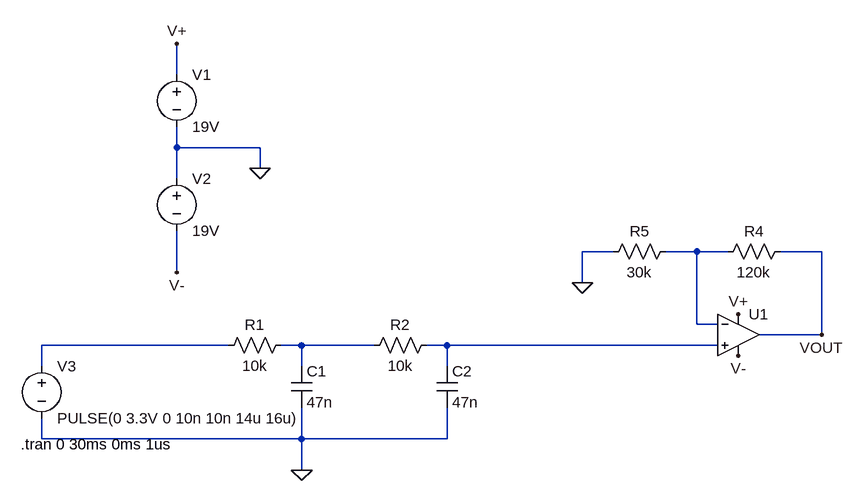
[diagram p0: schematic low_pass_amp.asc]
low_pass_amp.asc, the LTspice schematic file:
Version 4
SHEET 1 1028 680
WIRE -16 -288 -16 -336
WIRE -16 -176 -16 -208
WIRE 112 -176 -16 -176
WIRE 112 -144 112 -176
WIRE -16 -128 -16 -176
WIRE 656 -16 608 -16
WIRE 784 -16 736 -16
WIRE 832 -16 784 -16
WIRE 976 -16 912 -16
WIRE -16 16 -16 -48
WIRE 608 32 608 -16
WIRE 784 96 784 -16
WIRE 816 96 784 96
WIRE 976 112 976 -16
WIRE 976 112 880 112
WIRE 64 128 -224 128
WIRE 176 128 144 128
WIRE 288 128 176 128
WIRE 400 128 368 128
WIRE 816 128 400 128
WIRE -224 160 -224 128
WIRE 176 160 176 128
WIRE 400 160 400 128
WIRE -224 272 -224 240
WIRE 176 272 176 224
WIRE 176 272 -224 272
WIRE 400 272 400 224
WIRE 400 272 176 272
WIRE 176 320 176 272
FLAG 608 32 0
FLAG -16 -336 V+
FLAG -16 16 V-
FLAG 112 -144 0
FLAG 848 80 V+
FLAG 848 144 V-
FLAG 976 112 VOUT
FLAG 176 320 0
SYMBOL res 160 112 R90
WINDOW 0 0 56 VBottom 2
WINDOW 3 32 56 VTop 2
SYMATTR InstName R1
SYMATTR Value 10k
SYMBOL cap 160 160 R0
SYMATTR InstName C1
SYMATTR Value 47n
SYMBOL res 384 112 R90
WINDOW 0 0 56 VBottom 2
WINDOW 3 32 56 VTop 2
SYMATTR InstName R2
SYMATTR Value 10k
SYMBOL cap 384 160 R0
SYMATTR InstName C2
SYMATTR Value 47n
SYMBOL Opamps\\UniversalOpamp2 848 112 R0
SYMATTR InstName U1
SYMBOL res 928 -32 R90
WINDOW 0 0 56 VBottom 2
WINDOW 3 32 56 VTop 2
SYMATTR InstName R4
SYMATTR Value 120k
SYMBOL res 752 -32 R90
WINDOW 0 0 56 VBottom 2
WINDOW 3 32 56 VTop 2
SYMATTR InstName R5
SYMATTR Value 30k
SYMBOL voltage -16 -304 R0
WINDOW 123 0 0 Left 2
WINDOW 39 0 0 Left 2
SYMATTR InstName V1
SYMATTR Value 19V
SYMBOL voltage -16 -144 R0
WINDOW 123 0 0 Left 2
WINDOW 39 0 0 Left 2
SYMATTR InstName V2
SYMATTR Value 19V
SYMBOL voltage -224 144 R0
WINDOW 123 0 0 Left 2
WINDOW 39 0 0 Left 2
SYMATTR InstName V3
SYMATTR Value PULSE(0 3.3V 0 10n 10n 14u 16u)
TEXT -256 280 Left 2 !.tran 0 30ms 0ms 1us

The netlist it stands for:
* low_pass_amp.asc
R1 N003 N002 10k
C1 N003 0 47n
R2 N004 N003 10k
C2 N004 0 47n
XU1 N004 N001 V+ V- VOUT level.2 Avol=1Meg GBW=10Meg Slew=10Meg ilimit=25m rail=0 Vos=0 phimargin=45 en=0 enk=0 in=0 ink=0 Rin=500Meg  ; pins IN+ IN- V+ V- OUT
R4 VOUT N001 120k
R5 N001 0 30k
V1 V+ 0 19V
V2 0 V- 19V
V3 N002 0 PULSE(0 3.3V 0 10n 10n 14u 16u)
.tran 0 30ms 0ms 1us
.lib UniversalOpamps2.sub
.backanno
.end